# EAGLE design H0FR9 (EAGLE 9.6.1)

## Sheet 1 of 2
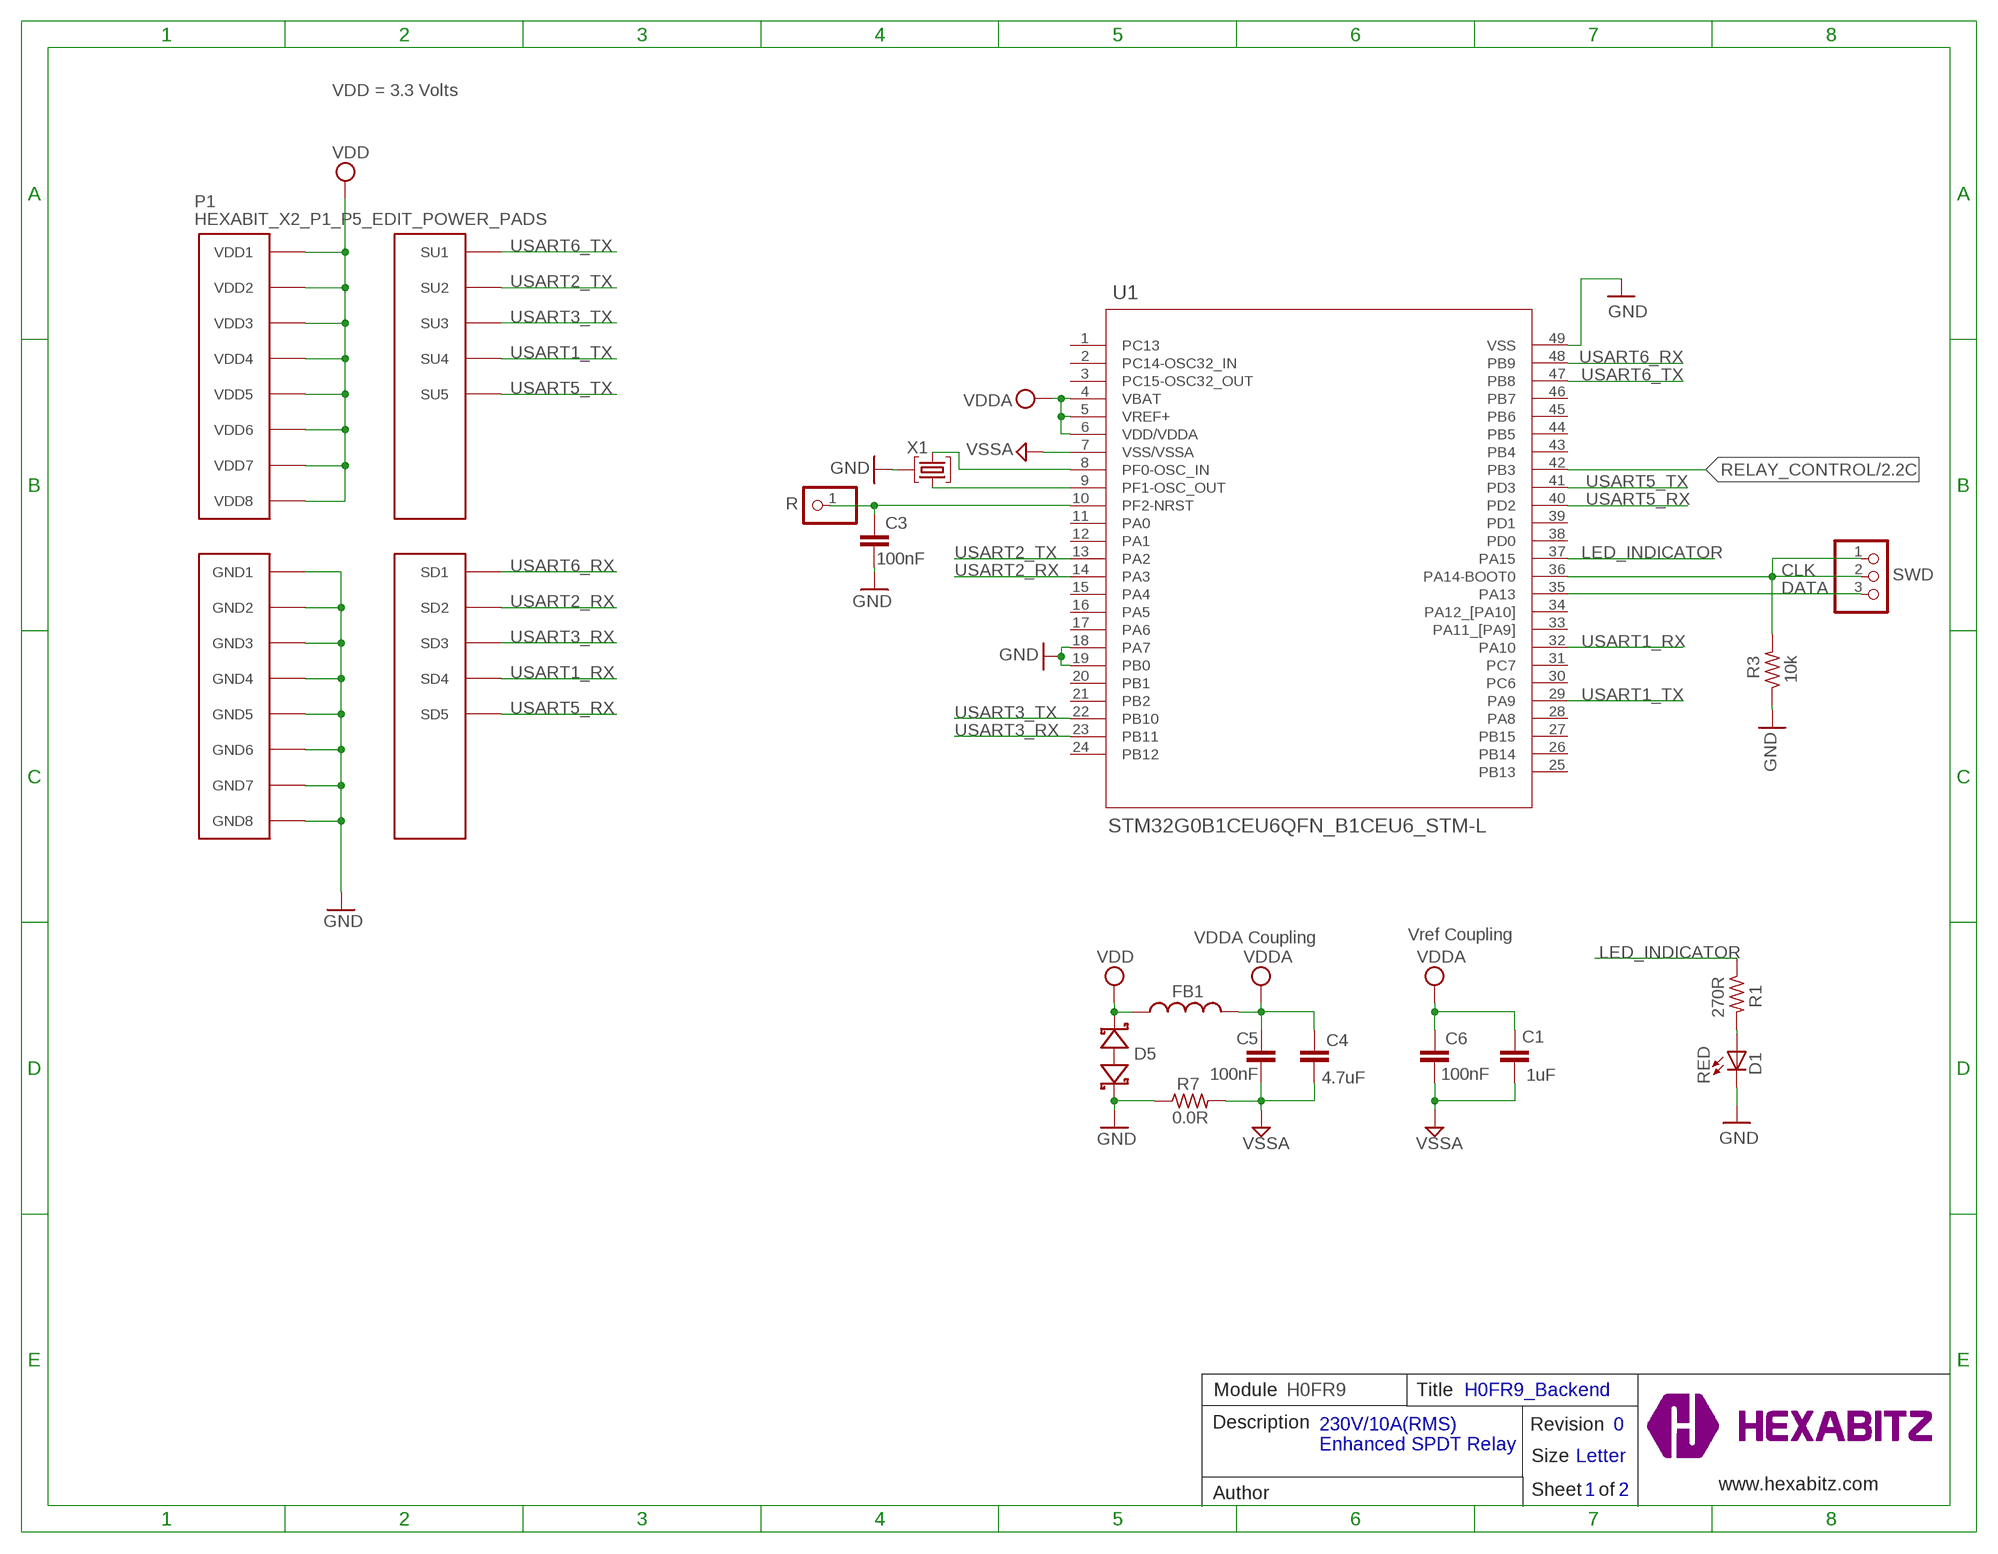
[diagram p0: schematic, sheet 1]

### Parts
C1  1uF  C-0805  [C-0805]
C3  100nF  C-0603  [C-0603]
C4  4.7uF  C-0805  [C-0805]
C5  100nF  C-0603  [C-0603]
C6  100nF  C-0603  [C-0603]
D1  RED  VLMS1300-GS08  [VLMS1300-GS08]
D5  BOURNS_CDSOD323-T03SCBOURNS_CDSOD323-T03SC_0_0  [BOURNS_CDSOD323-T03SC_0]
FB1  FB-0603  [FB-0603]
P1  HEXABIT_X2_P1_P5_EDIT_POWER_PADS  [HEXABIT_X2_P1_P5_EDIT_POWER_PADS]
R  R  PINHD-1X1  [1X01]
R1  270R  R-0603  [R-0603]
R3  10k  R-0603  [R-0603]
R7  0.0R  R-0603  [R-0603]
SWD  PINHD-1X3SWD  [SWD]
TRIMBLE-LOGO2  HEXA-LOGO  [HEXA-LOGO]
U1  STM32G0B1CEU6QFN_B1CEU6_STM-L  [QFN_B1CEU6_STM-L]
X1  XTALL_CSTCE8M00G52  [XTALL_CSTCE8M00G52]

### Nets
CLK: R3.2 SWD.1 SWD.2 U1.36(PA14-BOOT0)
DATA: SWD.3 U1.35(PA13)
GND: C3.2 D1.C D5.2(C) P1.PAD_PD11(GND1) P1.PAD_PD12(GND2) P1.PAD_PD13(GND3) P1.PAD_PD14(GND4) P1.PAD_PD17(GND5) P1.PAD_PD18(GND6) P1.PAD_PD19(GND7) P1.PAD_PD20(GND8) R3.1 R7.1 U1.18(PA7) U1.19(PB0) U1.49(VSS) X1.P$2 ; also sheet 2
LED_INDICATOR: R1.1 U1.37(PA15)
N$2: D1.A R1.2
N$4: C3.1 R.1 U1.10(PF2-NRST)
N$5: U1.9(PF1-OSC_OUT) X1.P$1
N$6: U1.8(PF0-OSC_IN) X1.P$3
RELAY_CONTROL: U1.42(PB3) ; also sheet 2
USART1_RX: P1.PAD_PD4(SD4) U1.32(PA10)
USART1_TX: P1.PAD_PU4(SU4) U1.29(PA9)
USART2_RX: P1.PAD_PD2(SD2) U1.14(PA3)
USART2_TX: P1.PAD_PU2(SU2) U1.13(PA2)
USART3_RX: P1.PAD_PD3(SD3) U1.23(PB11)
USART3_TX: P1.PAD_PU3(SU3) U1.22(PB10)
USART5_RX: P1.PAD_PD5(SD5) U1.40(PD2)
USART5_TX: P1.PAD_PU5(SU5) U1.41(PD3)
USART6_RX: P1.PAD_PD1(SD1) U1.48(PB9)
USART6_TX: P1.PAD_PU1(SU1) U1.47(PB8)
VDD: D5.1(A) FB1.1 P1.PAD_PU11(VDD1) P1.PAD_PU12(VDD2) P1.PAD_PU13(VDD3) P1.PAD_PU14(VDD4) P1.PAD_PU17(VDD5) P1.PAD_PU18(VDD6) P1.PAD_PU19(VDD7) P1.PAD_PU20(VDD8) ; also sheet 2
VDDA: C1.1 C4.1 C5.1 C6.1 FB1.2 U1.4(VBAT) U1.5(VREF+) U1.6(VDD/VDDA)
VSSA: C1.2 C4.2 C5.2 C6.2 R7.2 U1.7(VSS/VSSA)
Unconnected: U1.1(PC13) U1.2(PC14-OSC32_IN) U1.3(PC15-OSC32_OUT) U1.11(PA0) U1.12(PA1) U1.15(PA4) U1.16(PA5) U1.17(PA6) U1.20(PB1) U1.21(PB2) U1.24(PB12) U1.25(PB13) U1.26(PB14) U1.27(PB15) U1.28(PA8) U1.30(PC6) U1.31(PC7) U1.33(PA11_[PA9]) U1.34(PA12_[PA10]) U1.38(PD0) U1.39(PD1) U1.43(PB4) U1.44(PB5) U1.45(PB6) U1.46(PB7)

### Notes on the sheet
- VDD = 3.3 Volts
- BOOT
- VDDA Coupling | Vref Coupling
- Module | H0FR9 | Title | H0FR9_Backend
- Description | Revision | 0
- 230V/10A(RMS) 
  Enhanced SPDT Relay
- Size | Letter
- www.hexabitz.com
- Author | Sheet   of | 1 | 2
- C:/Users/Admin/Desktop/logodraft.bmp

## Sheet 2 of 2
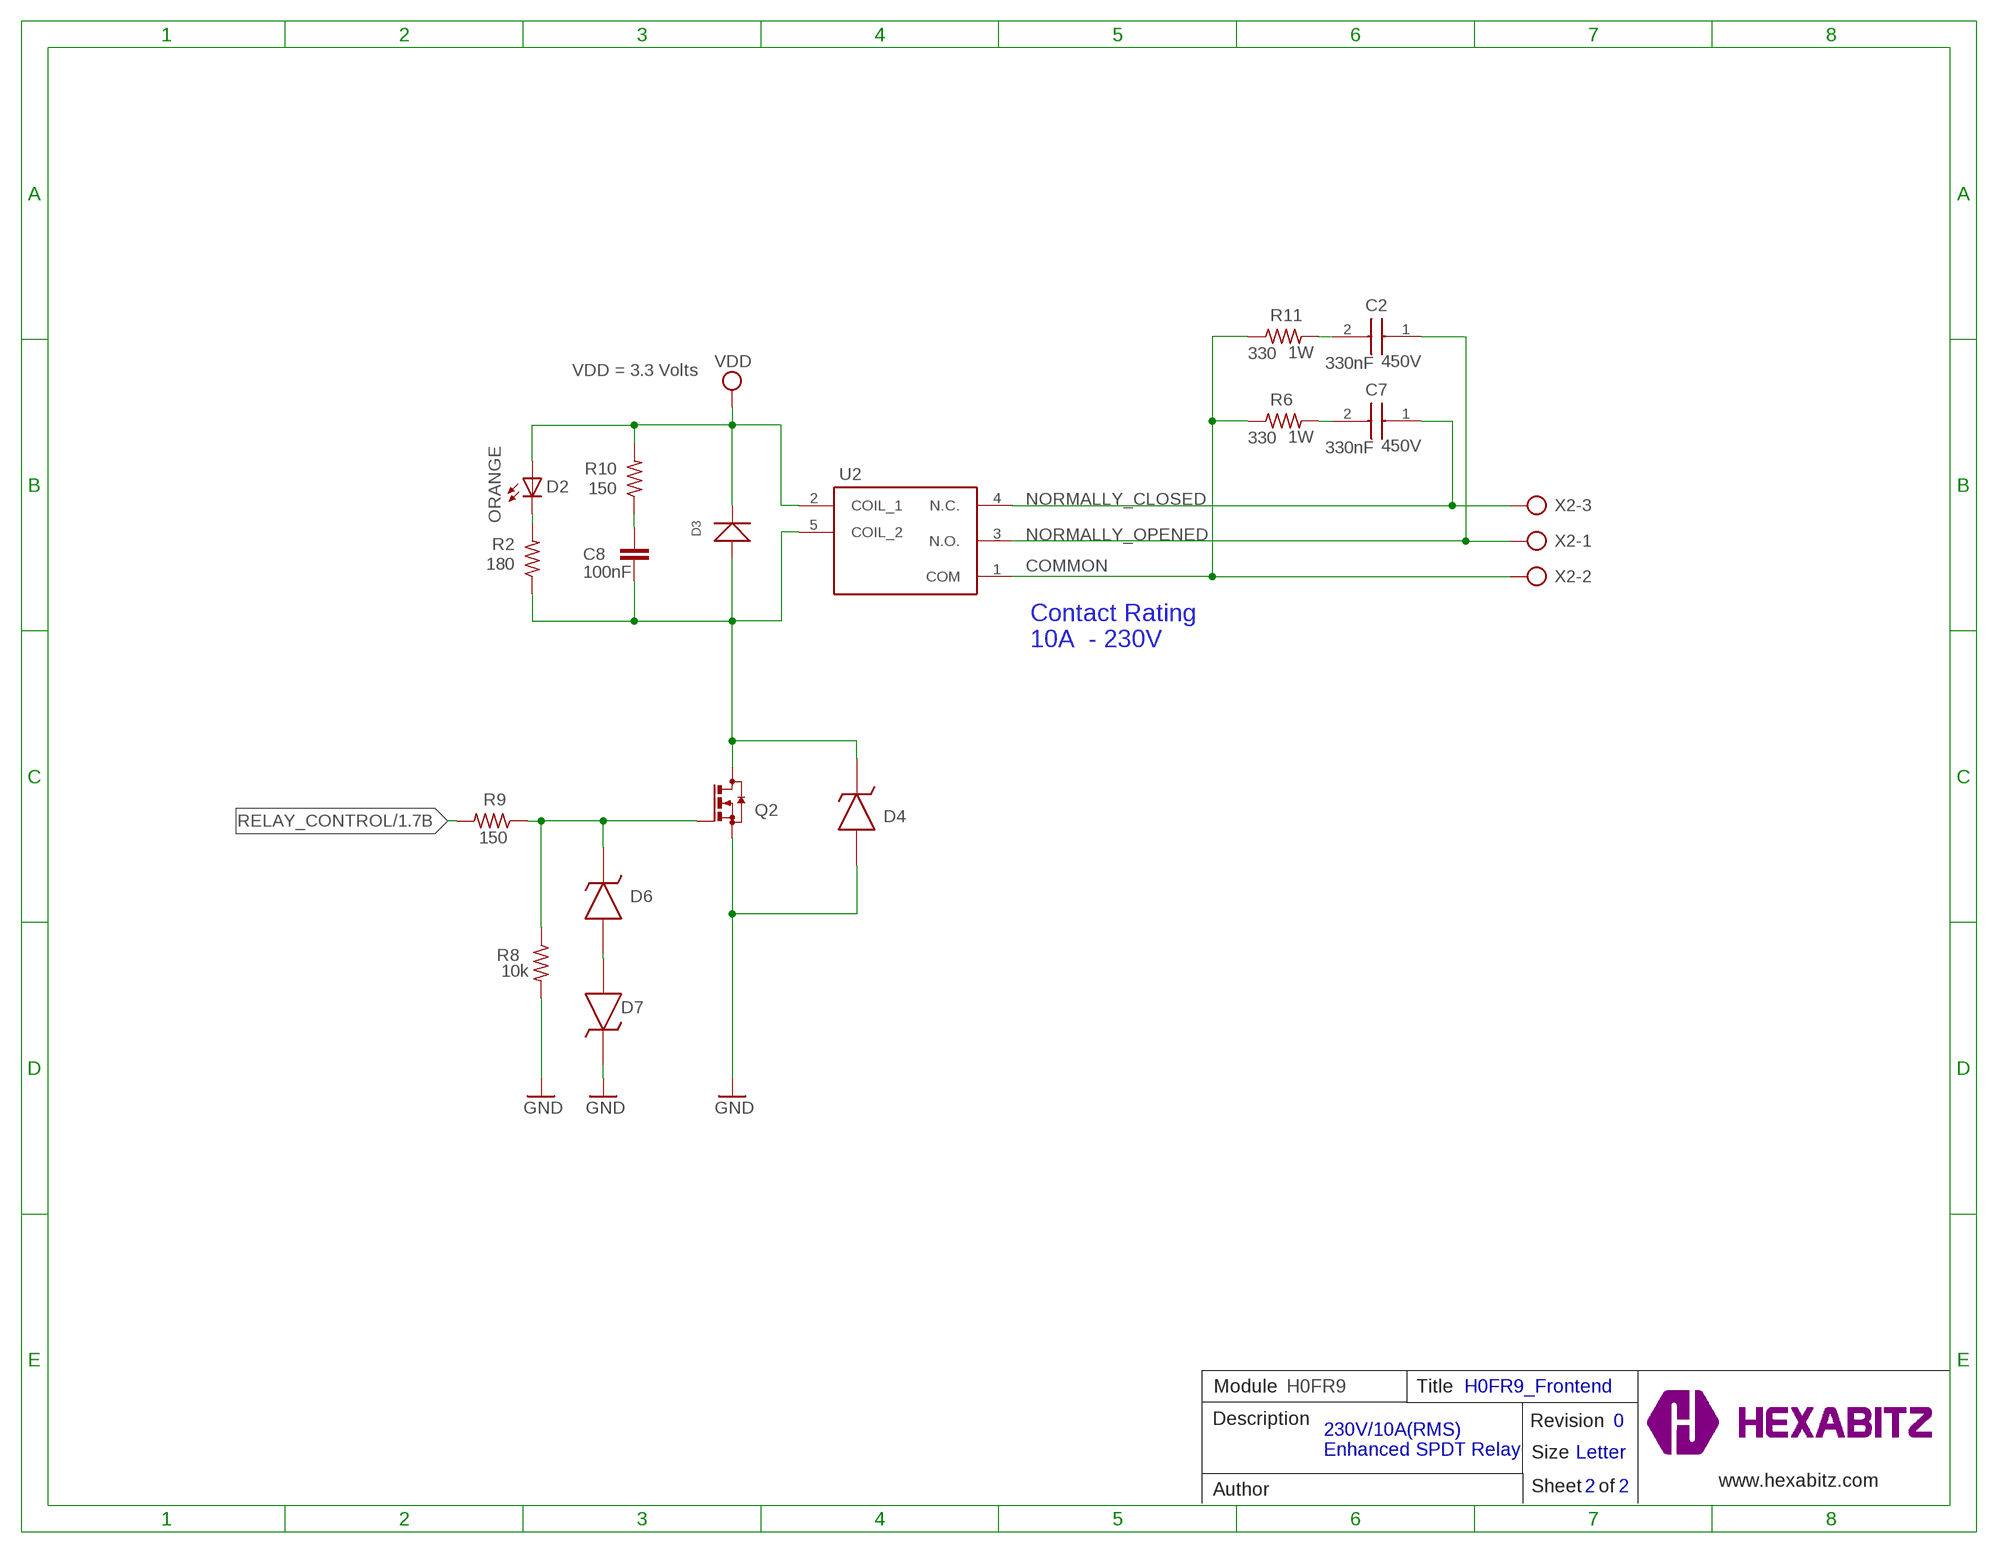
[diagram p1: schematic, sheet 2]

### Parts
C2  330nF  B32922Q3334K000  [B32922Q_(18_X_8.5)]
C7  330nF  B32922Q3334K000  [B32922Q_(18_X_8.5)]
C8  100nF  C-0603  [C-0603]
D2  ORANGE  VLMS1300-GS08  [VLMS1300-GS08]
D3  40V 300MA  BAT54JFILM_SOD-323  [SOD-323]
D4  MMSZ4705T1GMMSZ4705T1G  [DIO_MMSZ4700T1G]
D6  MMSZ4705T1GMMSZ4705T1G  [DIO_MMSZ4700T1G]
D7  MMSZ4705T1GMMSZ4705T1G  [DIO_MMSZ4700T1G]
Q2  BSS123  [SOT23]
R2  180  R-0603  [R-0603]
R6  330  R-US_R2512  [R2512]
R8  10k  R-0603  [R-0603]
R9  150  R-0603  [R-0603]
R10  150  R-0603  [R-0603]
R11  330  R-US_R2512  [R2512]
U2  G5LE-14_DC3  [G5LE-14_SPDT]
X2  AK300/3  [AK300/3]

### Nets
COMMON [ac]: R6.1 R11.1 U2.1(COM) X2.2
GND: D4.A D7.K Q2.2(S) R8.2 ; also sheet 1
N$1: D6.A D7.A
N$3: D6.K Q2.1(G) R8.1 R9.1
N$8: D2.C R2.2
N$9 [ac]: C2.2 R11.2
N$11: C8.1 R10.1
N$12 [ac]: C7.2 R6.2
N$15: C8.2 D3.+ D4.K Q2.3(D) R2.1 U2.5(COIL_2)
NORMALLY_CLOSED [ac]: C7.1 U2.4(N.C.) X2.3
NORMALLY_OPENED [ac]: C2.1 U2.3(N.O.) X2.1
RELAY_CONTROL: R9.2 ; also sheet 1
VDD: D2.A D3.- R10.2 U2.2(COIL_1) ; also sheet 1

### Notes on the sheet
- VDD = 3.3 Volts
- Contact Rating
  10A  - 230V
- Module | H0FR9 | Title | H0FR9_Frontend
- Description | Revision | 0
- 230V/10A(RMS) 
  Enhanced SPDT Relay
- Size | Letter
- www.hexabitz.com
- Author | Sheet   of | 2 | 2

## Library data of the parts
C1 = HEXABITZ_RCLS:C-0805: CAP CER 10% X7R 0805; CAPACITANCE: 1.00uF; MFN: Yageo; MPN: CC0805KKX7R7BB105; OCTOPART_URL: https://octopart.com/cc0805kkx7r7bb105-yageo-8376555?r=sp&s=YKl1wwtkROau_X5nniH2ig; TOLERANCE: 10%; VOLTAGE_RATING: 16V
C2 C7 = HEXABITZ_RCLS:B32922Q3334K000: EMI Suppression Capacitors Source: Datasheet <https://product.tdk.com/system/files/dam/doc/product/capacitor/film/emi/data_sheet/x2_b32922_924_p_q.pdf>; DESCRIPTION: EMI Suppression Capacitors; HEIGHT: 14.5mm; MANUFACTURER_NAME: TDK; MANUFACTURER_PART_NUMBER: B32922Q3334K000; MOUSER_PART_NUMBER: 871-B32922Q3334K000; MOUSER_PRICE-STOCK: https://www.mouser.co.uk/ProductDetail/EPCOS-TDK/B32922Q3334K000?qs=KUoIvG%2F9IlZpggMZ8F%2FNNQ%3D%3D; VOLTAAGE: 450V
C3 C5 = HEXABITZ_RCLS:C-0603: CAP CER 10% X7R 0603
C4 = HEXABITZ_RCLS:C-0805: CAP CER 10% X7R 0805; CAPACITANCE: 4.7uF; MFN: Murata; MPN: GRM21BC81E475KA12L; OCTOPART_URL: https://octopart.com/grm21bc81e475ka12l-murata-10331911?r=sp&s=RY3qZSD8T6mG6TC9CHI5qQ; TOLERANCE: 10%; VOLTAGE_RATING: 25V
C6 C8 = HEXABITZ_RCLS:C-0603: CAP CER 10% X7R 0603; CAPACITANCE: 100nF; MFN: KEMET; MPN: C0603C104K8RACTU; OCTOPART_URL: https://octopart.com/c0603c104k8ractu-kemet-145075?r=sp&s=9bS9ASSwSEqMCE9KBEQZ0g; TOLERANCE: 10%; VOLTAGE_RATING: 10V
D1 = HEXABITZ_USER_INTERFACE_PARTS:VLMS1300-GS08: Red 0603 130° Clear 54 mcd 2 V Surface Mount ChipLED ; Octopart Url : http://octopart.com/vlms1300-gs08-vishay-21709201; MFN: Vishay; MPN: VLMS1300-GS08; OCTOPART_URL: https://octopart.com/vlms1300-gs08-vishay-21709201?r=sp&s=_gcP4_q8T1SC6PJQPTQ9yA
D2 = Hexabitz:VLMS1300-GS08: Red 0603 130° Clear 54 mcd 2 V Surface Mount ChipLED ; Octopart Url : http://octopart.com/vlms1300-gs08-vishay-21709201; COULOR: ORANGE; MFN: Vishay; MPN: VLMY1300-GS08; OCTOPART_URL: https://octopart.com/vlmy1300-gs08-vishay-21709204; VALUE: RED
D3 = HEXABITZ_RCLS:BAT54JFILM_SOD-323: 304020019; MPN: BAT54JFILM
D4 = HEXABITZ_RCLS:MMSZ4705T1G: 18 V Low Current ZenerDiodeVoltage Regulator Source: Datasheet <http://www.onsemi.com/pub/Collateral/MMSZ4678T1-D.PDF>; MPN: MMSZ4705T1G
D5 = HEXABITZ_RCLS:BOURNS_CDSOD323-T03SC: CDSOD323-TxxSC - TVS Diode Series; DESCRIPTION: Dio Tvs Vwm 03V 500W Bidir Sod323 / Tape & Reel - 7" Reel; MFN: Bourns; MPN: CDSOD323-T03SC; OCTOPART_URL: https://octopart.com/cdsod323-t03sc-bourns-10487153?r=sp
D6 D7 = HEXABITZ_RCLS:MMSZ4705T1G: 18 V Low Current ZenerDiodeVoltage Regulator Source: Datasheet <http://www.onsemi.com/pub/Collateral/MMSZ4678T1-D.PDF>; MPN: MMSZ5231BT3G
FB1 = HEXABITZ_RCLS:FB-0603: Ferrite Beads Multi-Layer 0603
P1 = hexabitz_connectors:HEXABIT_X2_P1_P5_EDIT_POWER_PADS
Q2 = HEXABITZ_RCLS:BSS123: N-CHANNEL MOS FET; DESCRIPTION: Transistor MOSFET Negative Channel 100 Volt 0.17A 3-Pin SOT-23; MFN: ON Semiconductor; MPN: BSS123; OCTOPART_URL: https://octopart.com/bss123-on+semiconductor-20837328?r=sp
R = HEXABITZ_USER_INTERFACE_PARTS:PINHD-1X1: PIN HEADER; MFN: TE Connectivity; MPN: 87227-1; OCTOPART_URL: https://octopart.com/87227-1-te+connectivity-39512052?r=sp
R1 R7 = HEXABITZ_RCLS:R-0603: Thick Film Resistors - SMD 0603
R2 = HEXABITZ_RCLS:R-0603: Thick Film Resistors - SMD 0603; MFN: Panasonic; MPN: ERJ-3GEYJ181V; OCTOPART_URL: https://octopart.com/erj-3geyj181v-panasonic-55403673; RESISTANCE: 180.0 Ω; TOLERANCE: ±5%
R3 = HEXABITZ_RCLS:R-0603: Thick Film Resistors - SMD 0603; MFN: Yageo; MPN: RC0603JR-0710KL; OCTOPART_URL: https://octopart.com/search?q=RC0603JR-0710KL&start=0; RESISTANCE: 10.0K Ohm; TOLERANCE: 5%
R6 R11 = HEXABITZ_RCLS:R-US_: RESISTOR, American symbol; MPN: RMCF2512JT330R; POWER: 1W; SPICEPREFIX: R
R8-R10 = HEXABITZ_RCLS:R-0603: Thick Film Resistors - SMD 0603; MFN: Yageo; MPN: RC0603JR-07680KL; OCTOPART_URL: https://octopart.com/rc0603jr-07680kl-yageo-40953169?r=sp; RESISTANCE: 680K Ohm; TOLERANCE: 5%
SWD = HEXABITZ_CONNECTION_PARTS:PINHD-1X3: PIN HEADER
TRIMBLE-LOGO2 = HEXABITZ_USER_INTERFACE_PARTS:HEXA-LOGO: Trimble-Logo
U1 = HEXABITZ_ICs:STM32G0B1CEU6; COPYRIGHT: Copyright (C) 2021 Ultra Librarian. All rights reserved.; MANUFACTURER_PART_NUMBER: STM32G0B1CEU6; MFR_NAME: STMicroelectronics
U2 = HEXABITZ_OTHER_PARTS:G5LE-14_DC: General Purpose Relays Power PCB Relay Source: Datasheet <https://omronfs.omron.com/en_US/ecb/products/pdf/en-g5le.pdf>; DESCRIPTION: General Purpose Relays Power PCB Relay; HEIGHT: mm; MANUFACTURER_NAME: Omron Electronics; MANUFACTURER_PART_NUMBER: G5LE-14 DC3; MOUSER_PART_NUMBER: 653-G5LE-14DC3; MOUSER_PRICE-STOCK: https://www.mouser.com/Search/Refine.aspx?Keyword=653-G5LE-14DC3
X1 = HEXABITZ_RCLS:XTALL_CSTCE8M00G52: MURATA CSTCE8M00G52-R0 RESONATOR, SMD, 8MHZ ; Octopart Url : https://octopart.com/cstce8m00g52-r0-murata-7145559; MFN: Murata; MPN: CSTCE8M00G52Z-R0; OCTOPART_URL: https://octopart.com/cstce8m00g52z-r0-murata-17755941?r=sp&s=JDnNJnrHQhyS8Zk4ofFWXw
X2 = HEXABITZ_CONNECTION_PARTS:AK300/3: CONNECTOR; MPN: 1715734; OC_FARNELL: unknown; OC_NEWARK: unknown

## Net classes
1 ac: clearance 1.016 mm

## Board
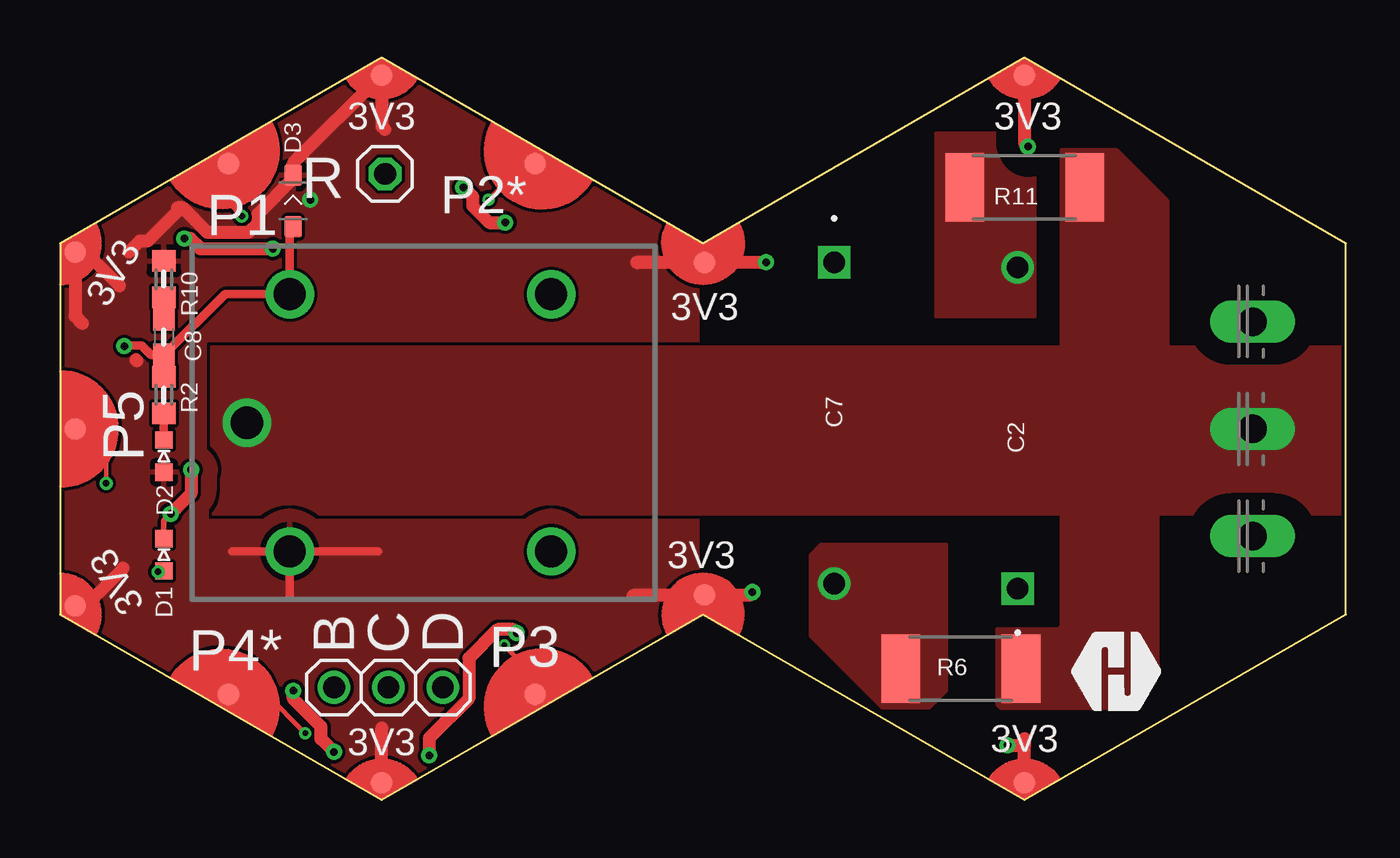
[diagram p2: board, top side]
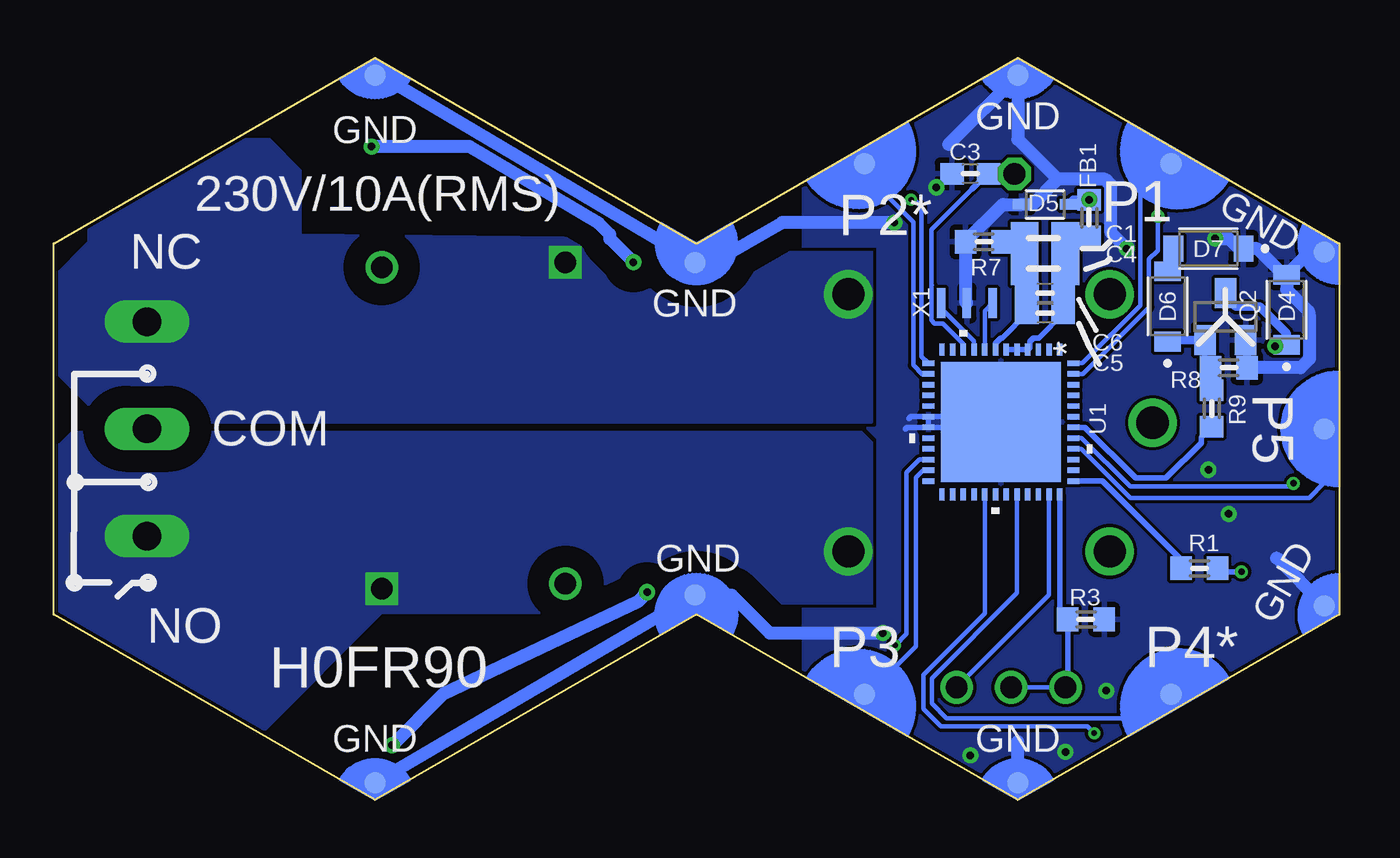
[diagram p3: board, bottom side, seen from below]

Size 60 x 34.64 mm. Coordinates in mm from the lower left corner, seen from the top.
Copper layers (1*16): Top 0.035mm / dielectric 1.5mm / Bottom 0.035mm
Design rules "2_layer *": minimum track width 6mil, minimum drill 0.25mm, track to track 6mil, track to pad 6mil, pad to pad 6mil, via to via 6mil, smd to smd 0mil, copper to edge 0.15mm, drill to drill 8mil, minimum pad ring 10mil, minimum via ring 6mil, stop-mask expansion 2mil, vias tented up to drill 15mil, thermal gap 10mil

### Footprints (pad centres in the part's own frame; a part is rotated, then mirrored left to right if it is on the bottom)
C-0805 = smd 1.3 x 1.5: 1 -0.95,0; 2 0.95,0
B32922Q_(18_X_8.5) = drill 1 pad 1.5 square: 1 0,0 | drill 1 pad 1.5: 2 15,0
C-0603 = smd 1.1 x 1: 1 -0.85,0; 2 0.85,0
VLMS1300-GS08 = smd 0.8 x 0.8: A 0,0.75; C 0,-0.75
SOD-323 = smd 1 x 0.8: + -1.2,0; - 1.2,0
DIO_MMSZ4700T1G = smd 0.915 x 1.22: A 1.637,0; K -1.637,0
BOURNS_CDSOD323-T03SC_0 = smd 0.8 x 0.5: 1 -1.1,0; 2 1.1,0
FB-0603 = smd 1 x 1.1: 1 -0.85,0; 2 0.85,0
HEXABIT_X2_P1_P5_EDIT_POWER_PADS = smd 1 x 1 bottom: PAD_PD1 12.39,22.39; PAD_PD2 12.39,8.09; PAD_PD3 -12.39,8.09; PAD_PD4 -12.39,22.39; PAD_PD5 0,29.55; PAD_PD12 16.52,15.24; PAD_PD13 7.752,0.168; PAD_PD14 16.52,-14.76; PAD_PD17 -16.52,-14.76; PAD_PD18 -7.752,0.168; PAD_PD19 -16.52,15.24 | smd 1 x 1 rotated 60 bottom: PAD_PD11 8.26,29.547 | smd 1 x 1 rotated 120 bottom: PAD_PD20 -8.26,29.547 | smd 1 x 1: PAD_PU1 12.39,22.39; PAD_PU2 12.39,8.09; PAD_PU3 -12.39,8.09; PAD_PU4 -12.39,22.39; PAD_PU5 0,29.55; PAD_PU12 16.52,15.24; PAD_PU13 7.752,0.168; PAD_PU14 16.52,-14.76; PAD_PU17 -16.52,-14.76; PAD_PU18 -7.752,0.168; PAD_PU19 -16.52,15.24 | smd 1 x 1 rotated 60: PAD_PU11 8.26,29.547 | smd 1 x 1 rotated 120: PAD_PU20 -8.26,29.547
SOT23 = smd 1 x 1.4: 1 -0.95,-1.1; 2 0.95,-1.1; 3 0,1.1
1X01 = drill 1.016 octagon: 1 0,0
R-0603 = smd 1 x 1.1: 1 -0.85,0; 2 0.85,0
R2512 = smd 1.8 x 3.2: 1 -2.8,0; 2 2.8,0
SWD = drill 1.016: 1 -2.54,0; 2 0,0; 3 2.54,0
QFN_B1CEU6_STM-L = smd 0.55 x 0.254: 1 -3.38,2.751; 2 -3.38,2.251; 3 -3.38,1.75; 4 -3.38,1.25; 5 -3.38,0.75; 6 -3.38,0.25; 7 -3.38,-0.25; 8 -3.38,-0.75; 9 -3.38,-1.25; 10 -3.38,-1.75; 11 -3.38,-2.251; 12 -3.38,-2.751; 25 3.38,-2.751; 26 3.38,-2.251; 27 3.38,-1.75; 28 3.38,-1.25; 29 3.38,-0.75; 30 3.38,-0.25; 31 3.38,0.25; 32 3.38,0.75; 33 3.38,1.25; 34 3.38,1.75; 35 3.38,2.251; 36 3.38,2.751 | smd 0.254 x 0.55: 13 -2.751,-3.38; 14 -2.251,-3.38; 15 -1.75,-3.38; 16 -1.25,-3.38; 17 -0.75,-3.38; 18 -0.25,-3.38; 19 0.25,-3.38; 20 0.75,-3.38; 21 1.25,-3.38; 22 1.75,-3.38; 23 2.251,-3.38; 24 2.751,-3.38; 37 2.751,3.38; 38 2.251,3.38; 39 1.75,3.38; 40 1.25,3.38; 41 0.75,3.38; 42 0.25,3.38; 43 -0.25,3.38; 44 -0.75,3.38; 45 -1.25,3.38; 46 -1.75,3.38; 47 -2.251,3.38; 48 -2.751,3.38 | smd 5.6 x 5.6: 49 0,0
G5LE-14_SPDT = drill 1.5 pad 2.25: 1 -2,6; 2 0,0; 3 12.2,0; 4 12.2,12; 5 0,12
XTALL_CSTCE8M00G52 = smd 1.4 x 0.4: P$1 0,1.2; P$2 0,0; P$3 0,-1.2
AK300/3 = drill 1.321 long: 1 -5.004,0; 2 0,0; 3 5.004,0

### Placement (x,y rotation side)
C1  13.73,26.21 180 bottom
C2  44.69,9.86 90 top
C3  17.22,29.23 180 bottom
C4  13.73,24.78 180 bottom
C5  13.73,22.72 180 bottom
C6  13.73,23.67 180 bottom
C7  36.11,25.1 270 top
C8  4.84,21.61 270 top
D1  4.84,11.45 180 top
D2  4.84,16.05 180 top
D3  10.87,27.96 90 top
D4  2.46,22.88 90 bottom
D5  13.73,27.8 180 bottom
D6  8.01,23.04 90 bottom
D7  6.11,25.73 180 bottom
FB1  11.67,27.16 270 bottom
P1  30.24,17.32 90 top
Q2  5.32,22.56 0 bottom
R  15.16,29.23 90 top
R1  6.53,10.81 0 bottom
R2  4.84,18.91 270 top
R3  11.82,8.43 180 bottom
R6  42.03,6.13 180 top
R7  16.59,26.05 0 bottom
R8  5.16,20.18 0 bottom
R9  5.95,18.27 270 bottom
R10  4.84,24.3 90 top
R11  45,28.59 180 top
SWD  15.32,5.26 0 top
TRIMBLE-LOGO2  49.29,4.14 0 top
U1  15.79,17.64 270 bottom
U2  10.71,11.61 0 top
X1  17.38,23.19 90 bottom
X2  55.64,17.32 90 top

### Tracks (layer width: path | path; a pad name or v marks a point on that pad's centre or on a via)
CLK
  Bottom 0.203: SWD.2 SWD.1
  Bottom 0.254: SWD.1 12.68,5.36 R3.2 13.04,8.8 U1.36
COMMON
  pour Top (no thermals): 59.77,21.13 7.06,21.13 7.06,13.35 59.77,13.35
  pour Top (no thermals): 43.73,7.8 43.73,4.46 43.89,4.3 49.29,4.3 51.19,6.21 51.19,16.69 51.04,16.84 46.75,16.84 46.75,8.11 46.59,7.95 43.73,7.95
  pour Top (no thermals): 46.75,30.34 46.75,18.75 51.67,18.75 51.67,27.96 49.29,30.34
DATA
  Bottom 0.203: SWD.3 13.54,9.57 U1.35
GND  (via drill 0.35 pad 0.75)
  Top 0.254: D1.C 4.84,13.03 5.4,13.59
  Top 0.61: v21.3,7.79 21.14,7.95 20.42,7.95 19.08,6.61 19.08,4.75 17.22,2.9 v17.22,2.08 | v12.78,2.24 12.17,2.84 12.17,3.42 10.87,4.72 v10.87,5.1 | v6.11,15.41 6.11,14.3 5.4,13.59 v5.16,13.35 | v5.79,26.21 6.07,26.21 6.55,25.72 9.1,25.72 9.11,25.73 v9.92,25.73 | v18.81,28.59 19.25,28.15 19.25,27.72 20.01,26.96 v20.76,26.96
  Bottom 0.254: U1.19 16.04,17.39 U1.49 16.04,17.89 U1.18 | U1.18 U1.19 | U1.18 19.99,17.89 20.08,17.8 | U1.19 20.17,17.39 20.24,17.32
  Bottom 0.406: Q2.2 4.31,21.4 R8.2
  Bottom 0.61: P1.PAD_PD18 31.18,8.46 | 45,1.29 P1.PAD_PD17 P1.PAD_PD18 | P1.PAD_PD18 28.36,9.57 26.59,7.79 v21.3,7.79 | 18.23,30.61 P1.PAD_PD12 15,30.83 13.14,28.97 | P1.PAD_PD11 1.39,25.58 D4.A | P1.PAD_PD20 2.92,11.29 2.93,11.29 | D4.A 2.46,23.83 1.43,22.8 1.43,22.64 1.39,22.6 1.39,20.59 1.81,20.18 R8.2 | D4.A 2.62,24.51 3.84,25.73 D7.K 4.68,25.73 5.16,26.21 v5.79,26.21 | X1.P$2 17.44,23.25 R7.1 15.69,27.8 D5.2 14.31,27.8 13.14,28.97 | v20.76,26.96 26,26.96 29.26,25.07 P1.PAD_PD13 | P1.PAD_PD13 30.07,25.11 29.76,25.42 | v9.92,25.73 10.66,26.47 10.66,28.7 10.93,28.97 13.14,28.97 | P1.PAD_PD14 44.73,33.84 30.25,25.25 P1.PAD_PD13 | P1.PAD_PD19 15,1.44 15,2.71
  pour Bottom (rank 2): 25,37.01 25,5.1 17.86,-2.05 7.06,-2.05 -4.05,9.07 -4.05,31.45 1.51,37.01
LED_INDICATOR
  Bottom 0.254: R1.1 7.38,11.2 11.07,14.89 U1.37
N$1
  Bottom 0.406: D6.A 7.75,24.94 D7.A
N$2  (via drill 0.3 pad 0.6)
  Top 0.254: D1.A 4.58,10.7 v4.57,10.65
  Bottom 0.254: R1.2 5.52,10.65 v4.57,10.65
N$3
  Bottom 0.254: R9.1 5.95,20.12 R8.1 6.27,20.44 Q2.1
  Bottom 0.406: D6.K 7.95,21.46 Q2.1
N$4
  Bottom 0.203: 19.04,24 19.04,22.39 18.89,22.24 18.51,22.24 17.54,21.28 U1.10 | 19.01,24.03 19.04,24 | 19.04,24 19.04,26.62 17.14,28.51
  Bottom 0.254: 17.14,28.51 16.43,29.23 C3.1 R.1
N$5
  Bottom 0.203: U1.9 17.04,21.43 18.58,22.96 X1.P$1
N$6
  Bottom 0.203: X1.P$3 16.54,22.83 U1.8
N$8
  Top 0.406: D2.C R2.2
N$9
  pour Top (no thermals): 40.88,31.13 40.88,22.56 45.48,22.56 45.48,31.13
N$11
  Top 0.406: C8.1 R10.1
N$12
  pour Top (no thermals): 35,11.45 35,7.64 38.34,4.3 40.56,4.3 41.35,5.1 41.35,11.92 35.48,11.92
N$15  (via drill 0.35 pad 0.75)
  Top 0.406: U2.5 10.71,26.6 D3.+ | U2.5 10.41,23.3 | C8.2 4.78,20.81 | U2.5 7.69,23.6 C8.2 | R2.1 C8.2 | C8.2 4.24,20.76 3.8,21.2 2.99,21.2 v2.99,21.18
  Bottom 0.406: D4.K 2.46,21.76 3.72,23.02 4.84,23.02 5.32,23.5 Q2.3
  Bottom 0.508: D4.K 2.94,21.24 v2.99,21.18
NORMALLY_CLOSED
  pour Bottom (no thermals): 21.83,26.07 21.83,17.64 57.55,17.64 59.93,20.02 59.93,24.46 58.34,26.05 58.34,26.69 54.21,30.81 49.92,30.81 48.5,29.39 48.5,26.37
NORMALLY_OPENED
  pour Bottom (no thermals): 59.13,17.16 22.3,17.16 21.83,16.69 21.83,8.75 44.69,8.75 50.24,3.19 54.37,3.19 60.24,9.07 60.24,16.05
RELAY_CONTROL
  Bottom 0.254: R9.2 6.45,16.93 6.45,16.67 8.09,15.02 9.49,15.02 11.86,17.39 U1.42
USART1_RX
  Bottom 0.203: U1.32 15.04,9.65 19.01,5.68 19.01,4.5 18.33,3.82 8.96,3.82 P1.PAD_PD4
USART1_TX  (via drill 0.25 pad 0.55)
  Top 0.203: v11.44,3.12 9.63,4.93 P1.PAD_PU4
  Bottom 0.203: U1.29 16.54,8.7 19.4,5.84 19.4,4.25 18.58,3.43 11.76,3.43 v11.44,3.12
USART2_RX
  Bottom 0.203: P1.PAD_PD2 22.15,29.23 19.88,26.96 19.88,20.29 19.45,19.86 19.2,19.86 U1.14
USART2_TX  (via drill 0.25 pad 0.55)
  Top 0.203: v19.99,28.02 21.67,29.71 P1.PAD_PU2
  Bottom 0.203: U1.13 19.49,20.71 19.49,27.69 19.82,28.02 v19.99,28.02
USART3_RX
  Bottom 0.203: P1.PAD_PD3 21.99,4.93 19.76,7.16 19.76,15.06 19.44,15.39 U1.23
USART3_TX  (via drill 0.25 pad 0.55)
  Top 0.203: v20.72,7.22 22.15,5.79 P1.PAD_PU3
  Bottom 0.203: v20.72,7.22 20.2,7.75 20.2,15.29 19.6,15.89 U1.22
USART5_RX
  Bottom 0.203: P1.PAD_PD5 0.69,14.81 1.39,14.11 9.75,14.11 12.03,16.39 U1.40
USART5_TX  (via drill 0.3 pad 0.6)
  Top 0.203: v2.14,14.78 2.14,15.87 P1.PAD_PU5
  Bottom 0.203: U1.41 12.03,16.89 9.76,14.62 2.3,14.62 v2.14,14.78
USART6_RX
  Bottom 0.203: 7.9,29.66 P1.PAD_PD1 9.29,28.27 9.29,23.08 11.98,20.39 U1.48
USART6_TX  (via drill 0.3 pad 0.6)
  Top 0.203: 8.45,29.11 P1.PAD_PU1 7.85,27.87 v8.47,27.25
  Bottom 0.203: U1.47 11.98,19.89 8.88,22.99 8.88,25.23 8.47,25.64 v8.47,27.25
VDD  (via drill 0.35 pad 0.75)
  Top 0.406: U2.2 8.02,11.6 | U2.2 14.84,11.6 | U2.2 10.71,9.54 | FB1.1 11.67,27.96
  Top 0.61: v32.94,25.1 30.1,25.1 P1.PAD_PU13 26.93,25.07 26.91,25.1 | P1.PAD_PU14 45,30.66 v45.16,30.5 | P1.PAD_PU17 45,2.87 45,2.56 v44.21,2.56 | v32.3,9.7 32.17,9.57 P1.PAD_PU18 30.05,9.54 26.75,9.54 | 1.03,22.24 0.69,22.58 P1.PAD_PU11 1.18,25.58 2.78,23.99 | 5.48,27.48 4.1,26.11 3.73,26.11 3.2,25.58 | 5.48,27.64 5.72,27.64 6.87,26.49 8.78,26.49 9.23,26.94 9.23,27.35 10.87,29 D3.- 10.87,29.71 P1.PAD_PU12 15,31.45 15.16,31.29 | 3.53,20.54 3.57,20.49 | P1.PAD_PU19 15,3.35 | P1.PAD_PU20 1.18,9.06 2.94,10.81
  Bottom 0.406: D5.1 12.42,28.01 FB1.1
  Bottom 0.508: 12.63,27.82 D5.1
  Bottom 0.61: v44.21,2.56 41.82,4.95 32.74,9.27 v32.3,9.7 | v32.94,25.1 34.04,26.2 34.04,26.4 34.56,26.92 40.59,30.5 v45.16,30.5
  other vias: 11.67,28.01
  pour Top (rank 2): 29.76,26.21 29.76,5.26 23.41,-1.09 21.83,-2.68 3.57,-2.68 -4.69,5.57 -4.69,26.85 5.16,36.69 25.95,36.69 29.76,32.88
VDDA
  Bottom 0.254: U1.6 U1.5 U1.4 14.45,21.11 14.45,21.41 14.29,21.57 14.03,21.57 C5.1
  Bottom 0.406: C1.1 11.77,26.21 FB1.2
  Bottom 0.508: C1.1 C4.1 12.78,23.77 C6.1 C5.1
VSSA
  Bottom 0.254: C5.2 15.73,21.57 15.79,21.57 16.04,21.31 U1.7
  Bottom 0.508: C5.2 C6.2 14.68,23.77 C4.2 C1.2 14.84,26.05 R7.2

### Text on the board
tPlace: 3V3 | 3V3 | R | P2* | P1 | 3V3 | 3V3 | P5 | 3V3 | 3V3 | P3 | P4* | B | C | D | 3V3 | 3V3
bPlace: GND | GND | P1 | P2* | 230V/10A(RMS) | GND | NC | GND | P5 | COM | GND | GND | P4* | P3 | NO | H0FR90 | GND | GND
tDocu: Note: This module should be / manufactured with 1oz copper / to handle 4A current.